# EAGLE design LED1_con (EAGLE 6.3)
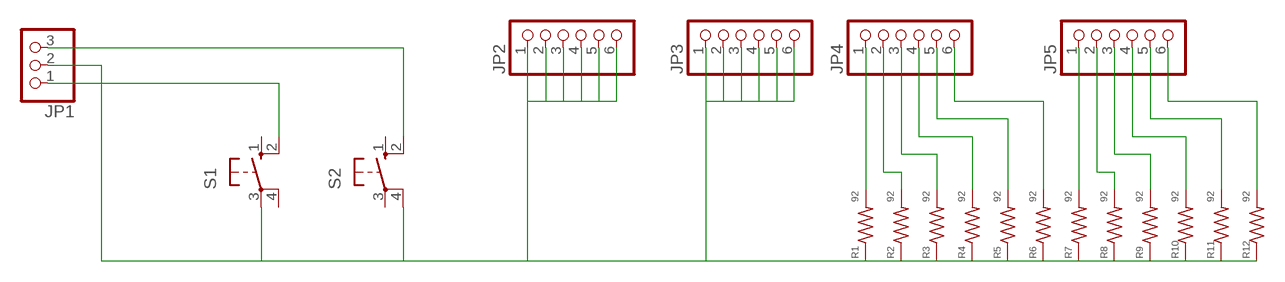
[diagram p0: schematic, sheet 1]

## Parts
JP1  PINHD-1X3  [1X03]
JP2  PINHD-1X6  [1X06]
JP3  PINHD-1X6  [1X06]
JP4  PINHD-1X6  [1X06]
JP5  PINHD-1X6  [1X06]
R1  92  R-US_R1206  [R1206]
R2  92  R-US_R1206  [R1206]
R3  92  R-US_R1206  [R1206]
R4  92  R-US_R1206  [R1206]
R5  92  R-US_R1206  [R1206]
R6  92  R-US_R1206  [R1206]
R7  92  R-US_R1206  [R1206]
R8  92  R-US_R1206  [R1206]
R9  92  R-US_R1206  [R1206]
R10  92  R-US_R1206  [R1206]
R11  92  R-US_R1206  [R1206]
R12  92  R-US_R1206  [R1206]
S1  10-XX  [B3F-10XX]
S2  10-XX  [B3F-10XX]

## Nets
N$1: JP1.3 S2.2(S1)
N$2: JP1.1 S1.2(S1)
N$3: JP1.2 JP2.1 JP2.2 JP2.3 JP2.4 JP2.5 JP2.6 JP3.1 JP3.2 JP3.3 JP3.4 JP3.5 JP3.6 R1.1 R2.1 R3.1 R4.1 R5.1 R6.1 R7.1 R8.1 R9.1 R10.1 R11.1 R12.1 S1.3(P) S2.4(P1)
N$4: JP4.1 R1.2
N$5: JP4.2 R2.2
N$6: JP4.3 R3.2
N$7: JP4.4 R4.2
N$8: JP4.5 R5.2
N$9: JP4.6 R6.2
N$10: JP5.1 R7.2
N$11: JP5.2 R8.2
N$12: JP5.3 R9.2
N$13: JP5.4 R10.2
N$14: JP5.5 R11.2
N$15: JP5.6 R12.2
Unconnected: S1.1(S) S1.4(P1) S2.1(S) S2.3(P)

## Library data of the parts
JP1 = Stofer:PINHD-1X3: PIN HEADER
JP2-JP5 = Headers:PINHD-1X6: PIN HEADER
R1-R12 = rcl:R-US_: RESISTOR, American symbol
S1 S2 = switch-omron:10-XX: OMRON SWITCH

## Board
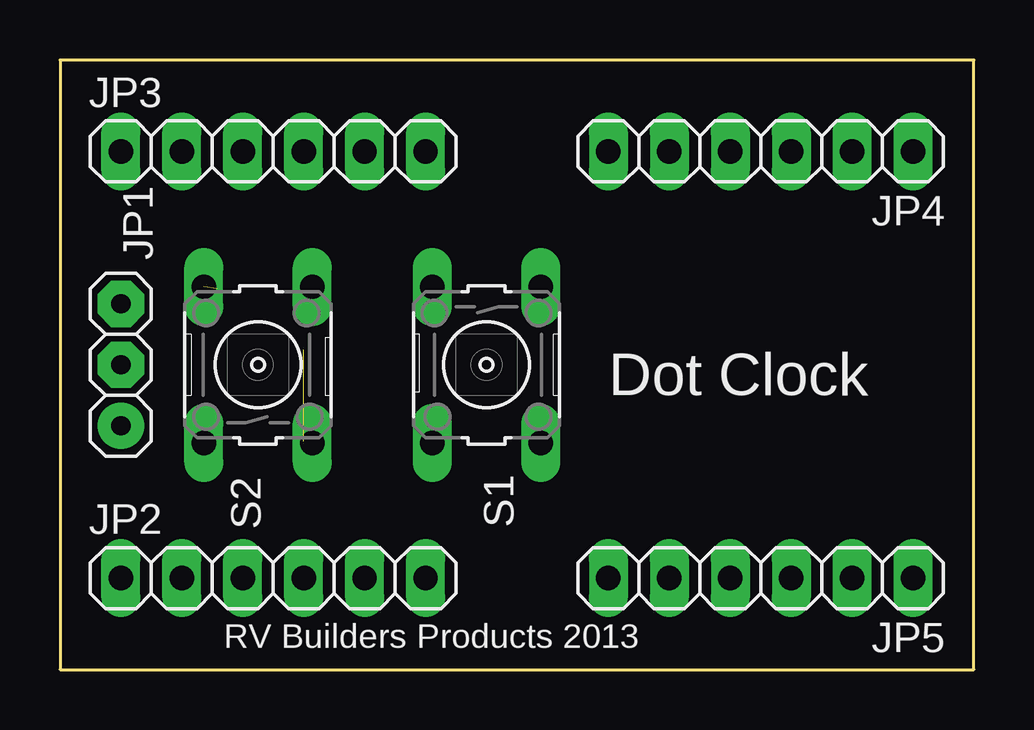
[diagram p1: board, top side]
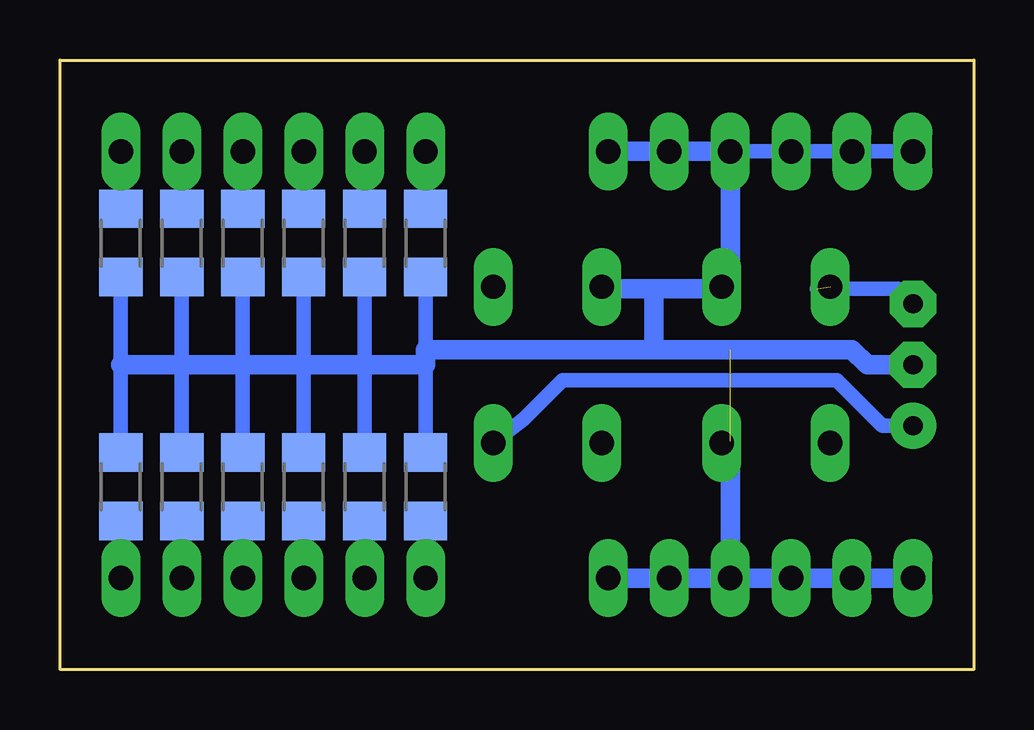
[diagram p2: board, bottom side, seen from below]

Size 38.1 x 25.4 mm. Coordinates in mm from the lower left corner, seen from the top.
Outline: 0,0 38.1,0 38.1,25.4 0,25.4 0,0
Copper layers (1*16): Top 0.035mm / dielectric 1.5mm / Bottom 0.035mm
Design rules "sparkfun": minimum track width 8mil, minimum drill 20mil, track to track 8mil, track to pad 8mil, pad to pad 8mil, via to via 8mil, smd to smd 8mil, copper to edge 10mil, drill to drill 8mil, minimum pad ring 12mil, minimum via ring 10mil, stop-mask expansion 4mil, vias tented up to drill 25mil, thermal gap 10mil

### Footprints (pad centres in the part's own frame; a part is rotated, then mirrored left to right if it is on the bottom)
1X03 = drill 0.8 pad 1.93: 1 -2.54,0 | drill 0.8 pad 1.93 octagon: 2 0,0; 3 2.54,0
1X06 = drill 1.016 long: 1 -6.35,0; 2 -3.81,0; 3 -1.27,0; 4 1.27,0; 5 3.81,0; 6 6.35,0
R1206 = smd 1.6 x 1.803: 1 -1.422,0; 2 1.422,0
B3F-10XX = drill 1.016 long: 1 -3.251,2.261; 2 3.251,2.261; 3 -3.251,-2.261; 4 3.251,-2.261

### Placement (x,y rotation side)
JP1  2.54,12.7 90 top
JP2  8.89,3.81 0 top
JP3  8.89,21.59 0 top
JP4  29.21,21.59 180 top
JP5  29.21,3.81 180 top
R1  35.56,17.78 90 bottom
R2  33.02,17.78 90 bottom
R3  30.48,17.78 90 bottom
R4  27.94,17.78 90 bottom
R5  25.4,17.78 90 bottom
R6  22.86,17.78 90 bottom
R7  35.56,7.62 270 bottom
R8  33.02,7.62 270 bottom
R9  30.48,7.62 270 bottom
R10  27.94,7.62 270 bottom
R11  25.4,7.62 270 bottom
R12  22.86,7.62 270 bottom
S1  17.78,12.7 270 top
S2  8.26,12.7 90 top

### Tracks (layer width: path | path; a pad name or v marks a point on that pad's centre or on a via)
N$1  (1 unrouted)
  Bottom 0.61: JP1.3 3.17,15.88 6.55,15.88
N$2
  Bottom 0.61: JP1.1 3.81,10.16 5.71,12.06 17.14,12.06 18.77,10.44 S1.2
N$3  (1 unrouted)
  Bottom 0.61: JP3.1 JP3.2 JP3.3 JP3.4 JP3.5 JP3.6 | R7.1 35.56,12.7 R1.1 | 22.86,13.34 R6.1 | R5.1 25.4,12.7 R11.1 | R4.1 27.94,12.7 R10.1 | R3.1 30.48,12.7 R9.1 | R2.1 33.02,12.7 R8.1 | 22.86,12.7 R12.1
  Bottom 0.813: 35.56,12.7 33.02,12.7 30.48,12.7 27.94,12.7 25.4,12.7 22.86,12.7 22.86,13.34 13.34,13.34 | JP1.2 4.45,12.7 5.08,13.34 10.79,13.34 | 10.79,13.34 13.34,13.34 | JP2.4 JP2.3 JP2.2 JP2.1 JP2.4 | JP2.6 JP2.5 JP2.4 | 10.79,13.34 11.15,13.34 | 13.34,13.34 14.25,13.34 | JP3.6 JP3.4 10.16,16.31 S2.4 10.59,15.88 13.34,15.88 | S1.3 15.44,15.88 13.34,15.88 | 13.34,13.34 13.34,15.88 | JP2.4 10.16,9.53
N$4
  Bottom 0.61: R1.2 JP4.1
N$5
  Bottom 0.61: R2.2 JP4.2
N$6
  Bottom 0.61: R3.2 JP4.3
N$7
  Bottom 0.61: R4.2 JP4.4
N$8
  Bottom 0.61: R5.2 JP4.5
N$9
  Bottom 0.61: R6.2 JP4.6
N$10
  Bottom 0.61: JP5.1 R7.2
N$11
  Bottom 0.61: JP5.2 R8.2
N$12
  Bottom 0.61: JP5.3 R9.2
N$13
  Bottom 0.61: JP5.4 R10.2
N$14
  Bottom 0.61: JP5.5 R11.2
N$15
  Bottom 0.61: JP5.6 R12.2

### Text on the board
tPlace: Dot Clock | RV Builders Products 2013